# EAGLE board spi1.1 (EAGLE 6.1)
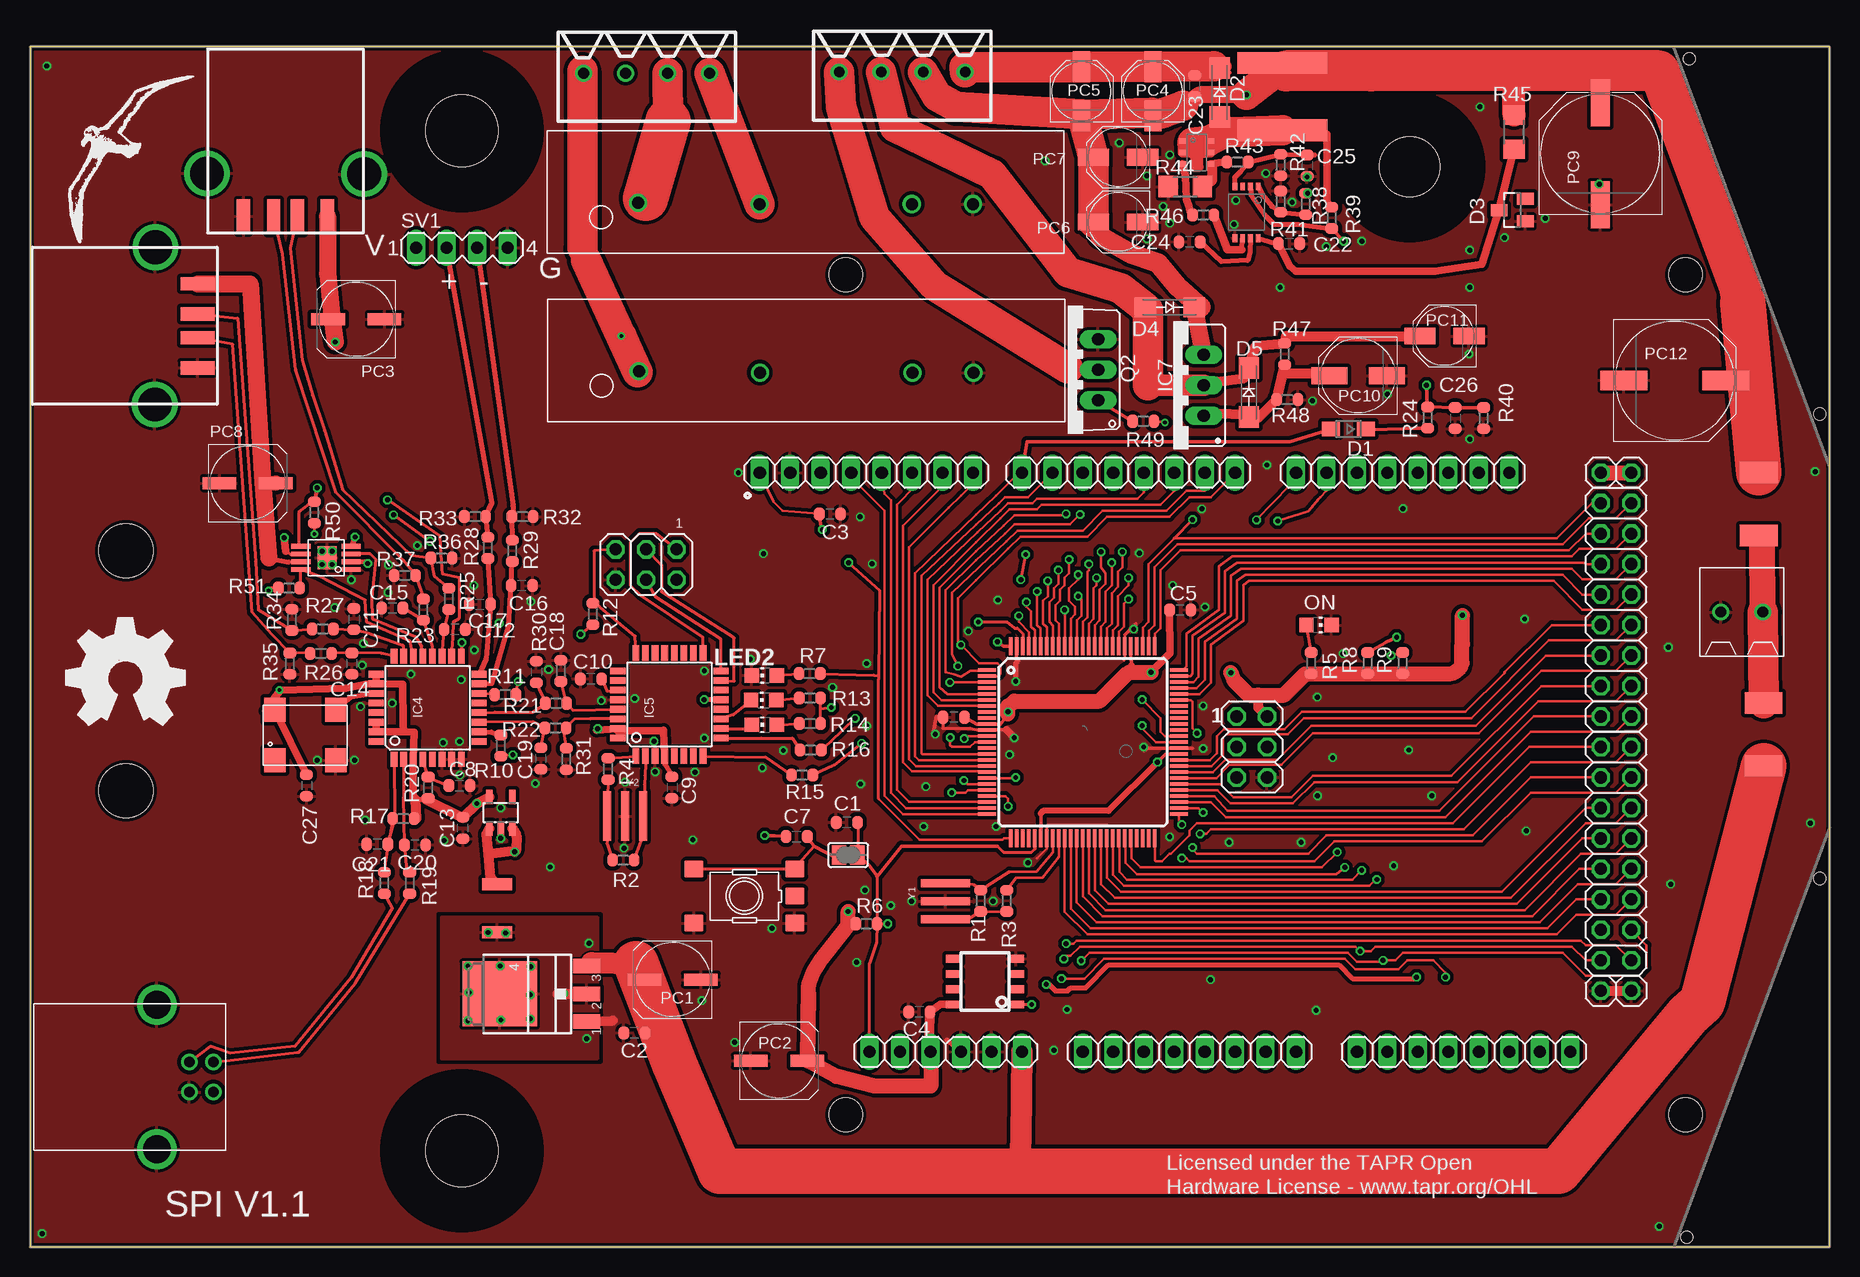
[diagram p2: board, top side]
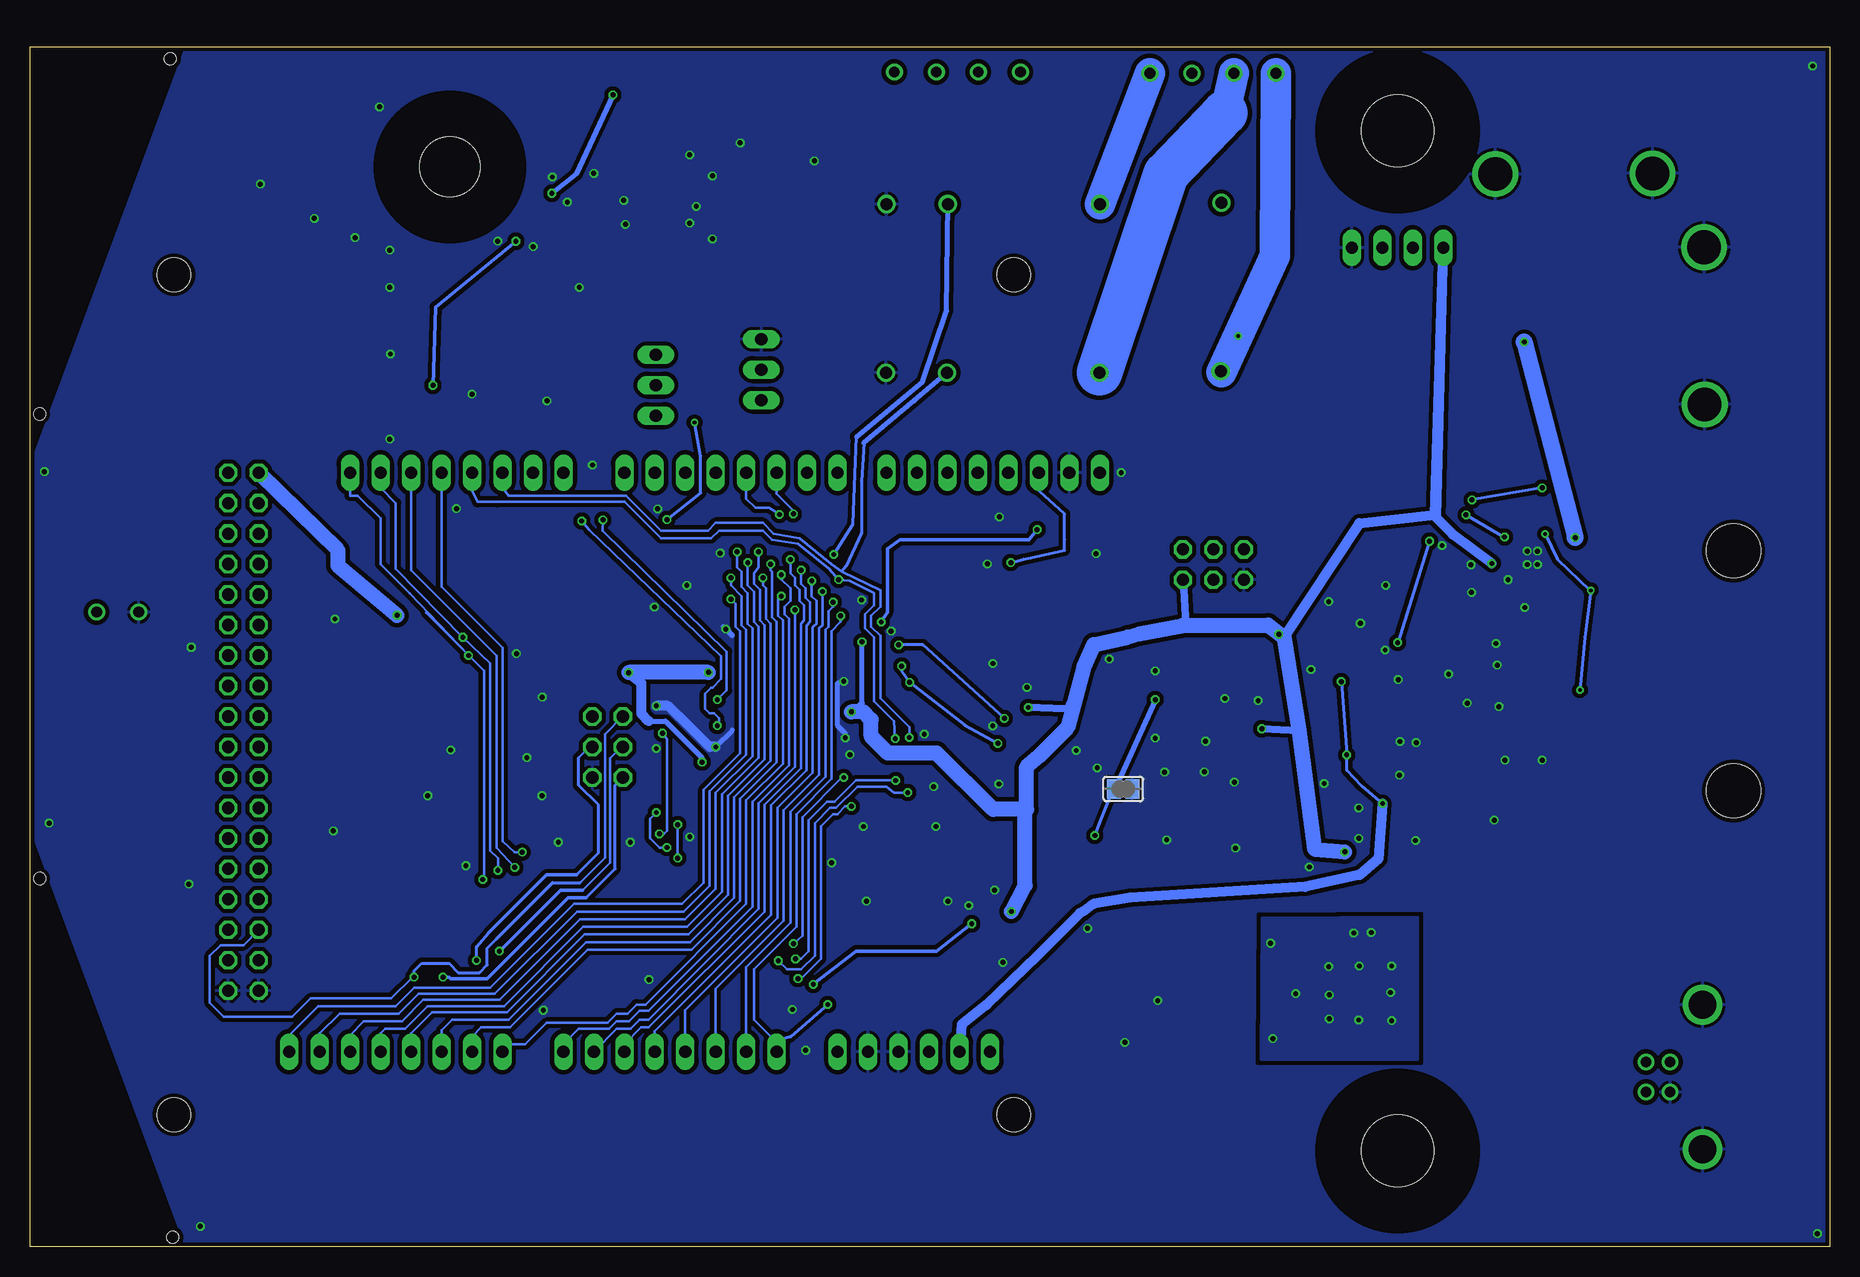
[diagram p3: board, bottom side, seen from below]

Size 150 x 100 mm. Coordinates in mm from the lower left corner, seen from the top.
Outline: 0,0 150,0 150,100 0,100 0,0
Copper layers (1*16): Top 0.035mm / dielectric 1.5mm / Bottom 0.035mm
Design rules: minimum track width 6mil, minimum drill 12mil, track to track 6mil, track to pad 6mil, pad to pad 6mil, via to via 6mil, smd to smd 0mil, copper to edge 10mil, drill to drill 10mil, minimum pad ring 10mil, minimum via ring 6mil, stop-mask expansion 2mil, vias tented up to drill 100mil, thermal gap 10mil
Net classes: 0 default: width 0.152 mm, drill 0.305 mm, clearance 0.152 mm
Holes 6 mm at 36,93 36,8
Holes 5 mm at 115,90
Holes 2.8 mm at 138,81 68,81 68,11 138,11
Holes 4.5 mm at 8,58 8,38
Holes 1 mm at 138.3,99 149.2,69.4 149.2,30.7 138.1,0.8
tKeepout: area 65,8 to 71,14; area 135,8 to 141,14; area 135,78 to 141,84; area 65,78 to 71,84; area 4,54 to 12,62; area 4,34 to 12,42
bKeepout: area 0,28 to 16,68
tRestrict: area 109,84 to 121,96; area 29.5,1.5 to 42.5,14.5; area 29.5,86.5 to 42.5,99.5
bRestrict: area 29.5,86.5 to 42.5,99.5; area 109,84 to 121,96; area 29.5,1.5 to 42.5,14.5

## Footprints (pad centres in the part's own frame; a part is rotated, then mirrored left to right if it is on the bottom)
1X08 = drill 1.016 long: 1 -8.89,0; 2 -6.35,0; 3 -3.81,0; 4 -1.27,0; 5 1.27,0; 6 3.81,0; 7 6.35,0; 8 8.89,0
C0603-ROUND = smd 0.898 x 1.1: 1 -0.889,0; 2 0.889,0
SOD323-W = smd 1.5 x 1.2: A 1.45,0; C -1.45,0
SMA-DO214AC = smd 1.8 x 1.7: A -2.05,0; K 2.05,0
SOT23 = smd 1 x 1.4: 1 -0.95,-1.1; 2 0.95,-1.1; 3 0,1.1
POLY6 = smd 2.5 x 1: 1 0,2; 2 0,-2
POLY15 = smd 3.15 x 1.78: 1 0,2.615; 2 0,-2.615
SOT223 = smd 1.219 x 2.235: 1 -2.311,-3.099; 2 0,-3.099; 3 2.311,-3.099 | smd 3.6 x 2.2: 4 0,3.099
DPACK = smd 1 x 1.6: 1 -2.28,-4.8; 3 2.28,-4.8 | smd 5.4 x 6.2: 2 0,2.5
TQFP100 = smd 1.5 x 0.3: 1 -8,6; 2 -8,5.5; 3 -8,5; 4 -8,4.5; 5 -8,4; 6 -8,3.5; 7 -8,3; 8 -8,2.5; 9 -8,2; 10 -8,1.5; 11 -8,1; 12 -8,0.5; 13 -8,0; 14 -8,-0.5; 15 -8,-1; 16 -8,-1.5; 17 -8,-2; 18 -8,-2.5; 19 -8,-3; 20 -8,-3.5; 21 -8,-4; 22 -8,-4.5; 23 -8,-5; 24 -8,-5.5; 25 -8,-6; 51 8,-6; 52 8,-5.5; 53 8,-5; 54 8,-4.5; 55 8,-4; 56 8,-3.5; 57 8,-3; 58 8,-2.5; 59 8,-2; 60 8,-1.5; 61 8,-1; 62 8,-0.5; 63 8,0; 64 8,0.5; 65 8,1; 66 8,1.5; 67 8,2; 68 8,2.5; 69 8,3; 70 8,3.5; 71 8,4; 72 8,4.5; 73 8,5; 74 8,5.5; 75 8,6 | smd 0.3 x 1.5: 26 -6,-8; 27 -5.5,-8; 28 -5,-8; 29 -4.5,-8; 30 -4,-8; 31 -3.5,-8; 32 -3,-8; 33 -2.5,-8; 34 -2,-8; 35 -1.5,-8; 36 -1,-8; 37 -0.5,-8; 38 0,-8; 39 0.5,-8; 40 1,-8; 41 1.5,-8; 42 2,-8; 43 2.5,-8; 44 3,-8; 45 3.5,-8; 46 4,-8; 47 4.5,-8; 48 5,-8; 49 5.5,-8; 50 6,-8; 76 6,8; 77 5.5,8; 78 5,8; 79 4.5,8; 80 4,8; 81 3.5,8; 82 3,8; 83 2.5,8; 84 2,8; 85 1.5,8; 86 1,8; 87 0.5,8; 88 0,8; 89 -0.5,8; 90 -1,8; 91 -1.5,8; 92 -2,8; 93 -2.5,8; 94 -3,8; 95 -3.5,8; 96 -4,8; 97 -4.5,8; 98 -5,8; 99 -5.5,8; 100 -6,8
TQFP32-08 = smd 1.27 x 0.559: 1 -4.293,2.8; 2 -4.293,2; 3 -4.293,1.2; 4 -4.293,0.4; 5 -4.293,-0.4; 6 -4.293,-1.2; 7 -4.293,-2; 8 -4.293,-2.8; 17 4.293,-2.8; 18 4.293,-2; 19 4.293,-1.2; 20 4.293,-0.4; 21 4.293,0.4; 22 4.293,1.2; 23 4.293,2; 24 4.293,2.8 | smd 0.559 x 1.27: 9 -2.8,-4.293; 10 -2,-4.293; 11 -1.2,-4.293; 12 -0.4,-4.293; 13 0.4,-4.293; 14 1.2,-4.293; 15 2,-4.293; 16 2.8,-4.293; 25 2.8,4.293; 26 2,4.293; 27 1.2,4.293; 28 0.4,4.293; 29 -0.4,4.293; 30 -1.2,4.293; 31 -2,4.293; 32 -2.8,4.293
SOT23-DBV = smd 0.55 x 1.2: 1 -0.95,-1.3; 2 0,-1.3; 3 0.95,-1.3; 4 0.95,1.3; 5 -0.95,1.3
317TS = drill 1.016 long: 1 -2.54,-2.54; 2 0,-2.54; 3 2.54,-2.54
DGN-8 = smd 1.6 x 0.4: 1 -2.1,0.975; 2 -2.1,0.325; 3 -2.1,-0.325; 4 -2.1,-0.975; 5 2.1,-0.975; 6 2.1,-0.325; 7 2.1,0.325; 8 2.1,0.975 | smd 1.57 x 1.89: GG -0.1,0
USOP-8 = smd 0.66 x 0.4: 1 -2.16,0.975; 2 -2.16,0.325; 3 -2.16,-0.325; 4 -2.16,-0.975; 5 2.16,-0.975; 6 2.16,-0.325; 7 2.16,0.325; 8 2.16,0.975
2X03 = drill 1.016 octagon: 1 -2.54,-1.27; 2 -2.54,1.27; 3 0,-1.27; 4 0,1.27; 5 2.54,-1.27; 6 2.54,1.27
USB-B = drill 0.9: 1 1.25,14.99; 2 -1.25,14.99; 3 -1.25,12.99; 4 1.25,12.99 | drill 2.3: G1 -6.02,10.28; G2 6.02,10.28
USB-A = smd 2.87 x 1.118: + 3.581,3.505; - 3.581,-3.505; D+ 3.581,-0.991; D- 3.581,0.991 | drill 2.8: G1 0.051,6.553; G2 0,-6.553
TERM3.5-4 = drill 0.9: 1 -5.25,0; 2 -1.75,0; 3 1.75,0; 4 5.25,0
TERM3.5-2 = drill 0.9: 1 1.75,0; 2 -1.75,0
1X01 = drill 1.016 octagon: 1 0,0
INDUCT1 = smd 7.5 x 1.8: 1 0,2.8; 2 0,-2.8
CHIP-LED0805 = smd 1.2 x 1.2: A 0,-1.05; C 0,1.05
UD-6,3X7,7_NICHICON = smd 2.8 x 1: + 2.35,0; - -2.35,0
PANASONIC_C = smd 2.6 x 1.4: + 2.05,0; - -2.05,0
PANASONIC_G = smd 3.9 x 1.6: + 4.25,0; - -4.25,0
PANASONIC_D = smd 3 x 1.4: + 2.4,0; - -2.4,0
1X06 = drill 1.016 long: 1 -6.35,0; 2 -3.81,0; 3 -1.27,0; 4 1.27,0; 5 3.81,0; 6 6.35,0
TO220AV = drill 1.016 long: B -2.54,-2.54; C 0,-2.54; E 2.54,-2.54
R0603-ROUND = smd 0.898 x 1.1: 1 -0.889,0; 2 0.889,0
R1206 = smd 1.6 x 1.803: 1 -1.422,0; 2 1.422,0
XRELAY = drill 1: 1 -27.9,0.1; 2 -17.8,0; 3 -5.1,0; 4 0,0
TS42 = smd 1.6 x 1.4: 1 -4.2,2.25; 2 4.2,2.25; 3 -4.2,-2.25; 4 4.2,-2.25; 5 -4.2,0
SJ = smd 1.168 x 1.6: 1 -0.762,0; 2 0.762,0
MA04-1 = drill 1.016 long: 1 -3.81,0; 2 -1.27,0; 3 1.27,0; 4 3.81,0
SS08 = smd 1.27 x 0.635: 1 -2.6,1.905; 2 -2.6,0.635; 3 -2.6,-0.635; 4 -2.6,-1.905; 5 2.6,-1.905; 6 2.6,-0.635; 7 2.6,0.635; 8 2.6,1.905
TSOP6 = smd 0.45 x 0.6: 1 -0.95,-1.17; 2 0,-1.17; 3 0.95,-1.17; 4 0.95,1.17; 5 0,1.17; 6 -0.95,1.17
2X08 = drill 1.016 octagon: 1 -8.89,-1.27; 2 -8.89,1.27; 3 -6.35,-1.27; 4 -6.35,1.27; 5 -3.81,-1.27; 6 -3.81,1.27; 7 -1.27,-1.27; 8 -1.27,1.27; 9 1.27,-1.27; 10 1.27,1.27; 11 3.81,-1.27; 12 3.81,1.27; 13 6.35,-1.27; 14 6.35,1.27; 15 8.89,-1.27; 16 8.89,1.27
RESONATOR1 = smd 0.7 x 4.1: 1 -1.5,0; 2 0,0; 3 1.5,0
XTAL1 = smd 1.8 x 2: 1 -2.54,-2.1; 2 2.54,-2.1; 3 2.54,2.1; 4 -2.54,2.1

## Placement (x,y rotation side)
ADCH  1X08  [1X08]  119.51,16.26 0 top
ADCL  1X08  [1X08]  96.65,16.26 0 top
C1  22p  [C0603-ROUND]  68.1,35.37 180 top
C2  100n  [C0603-ROUND]  50.38,17.83 180 top
C3  100n  [C0603-ROUND]  66.67,61.09 0 top
C4  100n  [C0603-ROUND]  74.14,19.57 180 top
C5  100n  [C0603-ROUND]  95.89,53.09 0 top
C6  100n  [C0603-ROUND]  77,44.13 180 top
C7  100n  [C0603-ROUND]  63.9,34.2 0 top
C8  100n  [C0603-ROUND]  35.8,38.44 0 top
C9  100n  [C0603-ROUND]  53.51,38.28 270 top
C10  1u  [C0603-ROUND]  46.77,47.33 180 top
C11  22pf  [C0603-ROUND]  27,52.3 270 top
C12  22pf  [C0603-ROUND]  35.4,51.45 180 top
C13  100n  [C0603-ROUND]  36.09,34.9 90 top
C14  22pf  [C0603-ROUND]  26.85,48.6 90 top
C15  22pf  [C0603-ROUND]  30.2,53.25 0 top
C16  22pf  [C0603-ROUND]  41,55.1 180 top
C17  22pf  [C0603-ROUND]  37.5,53.55 0 top
C18  22pf  [C0603-ROUND]  42.2,47.9 270 top
C19  22pf  [C0603-ROUND]  42.6,40.7 90 top
C20  22pf  [C0603-ROUND]  32.1,33.5 0 top
C21  22pf  [C0603-ROUND]  28.95,33.55 180 top
C22  100n 50v  [C0603-ROUND]  104.95,83.6 0 top
C23  100n 50v  [C0603-ROUND]  97.1,96.75 90 top
C24  100n 50v  [C0603-ROUND]  96.65,83.75 180 top
C25  470pf 50v  [C0603-ROUND]  106.45,90.1 270 top
C26  1nF 50v  [C0603-ROUND]  118.8,69.05 270 top
C27  10nF  [C0603-ROUND]  23.05,38.45 270 top
COMMUNICATION  1X08  [1X08]  114.43,64.52 180 top
D1  SD103CWS  [SOD323-W]  109.9,68.15 180 top
D2  CMSH1-60M  [SMA-DO214AC]  99.15,96.2 90 top
D3  MMBZ5251B-V  [SOT23]  123.55,86.4 90 top
D4  1N4004  [SMA-DO214AC]  95,78.3 0 top
D5  1N4004  [SMA-DO214AC]  101.6,71.2 90 top
F1  1210L035YR  [POLY6]  38.95,28.2 180 top
F2  1812L050PR  [POLY15]  144.5,42.7 0 top
F3  1812L050PR  [POLY15]  144.1,61.9 180 top
IC1  MC33269ST-5.0T3  [SOT223]  43.31,21.08 90 top
IC2  MC33269D-5.0  [DPACK]  41.66,21.08 90 top
IC3  ATMEGA2560-16AU  [TQFP100]  87.76,42.06 0 top
IC4  TUSB2046VF  [TQFP32-08]  33.15,44.92 90 top
IC5  AT90USB162  [TQFP32-08]  53.3,45.19 90 top
IC6  LP2985-33DBVR  [SOT23-DBV]  39.24,36.18 0 top
IC7  LM350  [317TS]  95.3,71.8 90 top
IC8  TPS2042B-DGN  [DGN-8]  24.68,57.42 180 top
IC9  MAX16802  [USOP-8]  101.4,86.2 270 top
ICSP  ICSP  [2X03]  101.85,41.66 270 top
ICSP1  ICSP  [2X03]  51.36,56.85 180 top
J43  USB-B-FCI  [USB-B]  0.3,14.15 270 top
J44  USB-A_S_RA  [USB-A]  21.3,89.45 270 top
J45  USB-A_S_RA  [USB-A]  10.4,76.75 0 top
J46  BLOCK4  [TERM3.5-4]  51.4,97.8 0 top
J47  BLOCK4  [TERM3.5-4]  72.7,97.9 0 top
J49  TERM-3.5-2  [TERM3.5-2]  142.7,52.9 0 top
JP1  [1X01]  130.94,64.52 0 top
JP2  [1X01]  133.48,64.52 0 top
JP3  [1X01]  130.94,21.34 0 top
JP4  [1X01]  133.48,21.34 0 top
L1  SRN3015-4R7M  [INDUCT1]  104.4,95.85 180 top
LED2  YELLOW  [CHIP-LED0805]  61.21,47.62 90 top
LED3  YELLOW  [CHIP-LED0805]  61.16,45.56 90 top
LED4  YELLOW  [CHIP-LED0805]  61.21,43.51 90 top
LOGO2  OSHW_LOGO_FILLX0350-NT  [OSHW_FILLX350_NOTEXT]  3,43.5 0 top
ON  LED1  [CHIP-LED0805]  107.44,51.82 270 top
PC1  47u  [UD-6,3X7,7_NICHICON]  53.57,22.28 180 top
PC2  47u  [UD-6,3X7,7_NICHICON]  62.43,15.5 0 top
PC3  100u  [UD-6,3X7,7_NICHICON]  27.2,77.3 180 top
PC4  4.7uF 50v  [PANASONIC_C]  93.6,96.3 90 top
PC5  4.7uF 50v  [PANASONIC_C]  87.65,96.3 90 top
PC6  4.7uF 50v  [PANASONIC_C]  90.7,85.4 180 top
PC7  4.7uF 50v  [PANASONIC_C]  90.7,90.8 180 top
PC8  100u  [UD-6,3X7,7_NICHICON]  18.15,63.65 0 top
PC9  220uF 50v  [PANASONIC_G]  130.9,91.1 90 top
PC10  10uF 50v  [PANASONIC_D]  110.7,72.6 180 top
PC11  4.7uF 12v  [PANASONIC_C]  117.9,75.9 180 top
PC12  220uF 50v  [PANASONIC_G]  137.1,72.2 0 top
POWER  1X06  [1X06]  76.33,16.26 0 top
PWMH  1X08  [1X08]  69.72,64.52 180 top
PWML  1X08  [1X08]  91.57,64.52 180 top
Q2  TIP120  [TO220AV]  86.5,73.1 90 top
R1  1M  [R0603-ROUND]  79.25,28.83 90 top
R2  1M  [R0603-ROUND]  49.46,32.22 0 top
R3  27R  [R0603-ROUND]  81.41,28.83 270 top
R4  27R  [R0603-ROUND]  48.19,39.83 270 top
R5  1k  [R0603-ROUND]  106.81,48.64 270 top
R6  10k  [R0603-ROUND]  69.72,26.92 0 top
R7  1k  [R0603-ROUND]  64.99,47.77 0 top
R8  10k  [R0603-ROUND]  111.51,48.64 90 top
R9  10k  [R0603-ROUND]  114.41,48.64 90 top
R10  10k  [R0603-ROUND]  39.24,41.77 270 top
R11  10k  [R0603-ROUND]  39.61,46.01 0 top
R12  10k  [R0603-ROUND]  46.92,52.74 90 top
R13  1k  [R0603-ROUND]  65.02,45.74 180 top
R14  1k  [R0603-ROUND]  65.02,43.61 180 top
R15  1k  [R0603-ROUND]  64.37,39.31 0 top
R16  1k  [R0603-ROUND]  65.07,41.39 0 top
R17  1.5k  [R0603-ROUND]  31.12,35.69 0 top
R18  27R  [R0603-ROUND]  29.54,30.32 270 top
R19  27R  [R0603-ROUND]  31.65,30.32 270 top
R20  10k  [R0603-ROUND]  33.19,38.26 270 top
R21  27R  [R0603-ROUND]  43.85,45.3 180 top
R22  27R  [R0603-ROUND]  43.8,43.25 180 top
R23  27R  [R0603-ROUND]  32.8,53.1 270 top
R24  1k 1%  [R0603-ROUND]  116.5,69.1 270 top
R25  27R  [R0603-ROUND]  34.9,54 270 top
R26  27R  [R0603-ROUND]  24.25,49.45 0 top
R27  27R  [R0603-ROUND]  24.4,51.5 0 top
R28  27R  [R0603-ROUND]  38.15,58.25 270 top
R29  27R  [R0603-ROUND]  40.2,58 270 top
R30  15k  [R0603-ROUND]  44.25,48 90 top
R31  15k  [R0603-ROUND]  44.7,40.65 270 top
R32  15k  [R0603-ROUND]  41.05,60.85 0 top
R33  15k  [R0603-ROUND]  37.1,60.85 180 top
R34  15k  [R0603-ROUND]  21.85,52.25 90 top
R35  15k  [R0603-ROUND]  21.65,48.6 270 top
R36  15k  [R0603-ROUND]  34.3,57.4 0 top
R37  15k  [R0603-ROUND]  31.25,55.95 180 top
R38  499k 1%  [R0603-ROUND]  106.35,86.9 270 top
R39  392k 1%  [R0603-ROUND]  108.5,85.75 270 top
R40  11k 1%  [R0603-ROUND]  121.15,69.05 270 top
R41  73k2 1%  [R0603-ROUND]  104.25,87.1 90 top
R42  1k 1%  [R0603-ROUND]  104.25,90.15 270 top
R43  220 1%  [R0603-ROUND]  100.65,90.4 0 top
R44  ,1 1%  [R1206]  96.3,88.35 180 top
R45  330 1%  [R1206]  123.7,92.9 270 top
R46  1  [R0603-ROUND]  97.8,86 0 top
R47  120  [R0603-ROUND]  104.6,74.4 270 top
R48  180  [R0603-ROUND]  104.8,70.6 0 top
R49  120  [R0603-ROUND]  92.8,68.8 180 top
R50  10k  [R0603-ROUND]  23.7,61.2 270 top
R51  10k  [R0603-ROUND]  21.6,54.9 180 top
RELAY1  XRELAY  [XRELAY]  78.6,86.9 0 top
RELAY2  XRELAY  [XRELAY]  78.65,72.85 0 top
RESET  TS42  [TS42]  59.54,29.23 180 top
RESET-EN  [SJ]  68.2,32.66 0 top
SV1  DNS  [MA04-1]  36,83.25 0 top
U$1  LM34  [SS08]  79.6,22.1 180 top
U$6  SI3458DVB  [TSOP6]  97.25,91.2 270 top
U$15  LOGO  [LOGO]  2.9,98.45 270 top
UBOOT  [SJ]  58.87,38.16 0 bottom
XIOH  2X08  [2X08]  132.21,53.09 90 top
XIOL  2X08  [2X08]  132.21,32.77 90 top
Y1  AWSCR  [RESONATOR1]  76.3,28.8 270 top
Y2  AWSCR  [RESONATOR1]  49.6,35.9 180 top
Y3  48MHZ  [XTAL1]  22.95,42.65 0 top

## Tracks (layer width: path | path; a pad name or v marks a point on that pad's centre or on a via)
+3V3  (via drill 0.3, 0.41)
  Top 0.254: 36.1,35.75 v37.25,36.94 | R11.2 v40.7,47.1 | v40.25,41 R10.2 | R20.2 33,37.3 | R17.2 32.2,35.69 32.15,35.75 | R51.2 19.9,54.9 v19.9,54.7 | v20.8,46.4 20.75,46.27 | R50.2 v23.7,59.4
  Top 0.406: 33,37.3 31.95,37.3 32.1,37.3 | 19.55,44.65 19.8,44.98 Y3.4
  Top 0.61: IC4.25 IC4.26 | IC4.30 IC4.31 31.13,42.94 | 31.95,37.3 IC4.3 32,42.9 31.13,42.94 | IC4.26 31.05,46.9 31.1,43.65 31.13,42.94 | IC4.26 28,46.9 26.3,46.55 20.85,46.4 20.75,46.27 19.8,44.98 | C27.1 Y3.4
  Top 0.813: 33,37.3 36.1,35.75 | IC6.5 v37.25,36.94 C13.2 | 32.1,37.3 32.2,35.69
  Bottom 0.254: v40.7,47.1 v40.25,41 40.25,39.7 39,38.4 v37.25,36.94 | v20.8,46.4 20.4,50.8 v19.9,54.7 20,54.7 22.7,57.3 v23.7,59.4
  Bottom 0.61: 62.23,27.94 62.48,27.81
  Bottom 0.813: 62.48,27.81 66.04,24.26 70.27,20.16 72.35,18.53 POWER.2 | 62.23,27.94 61.34,28.57 58.3,29.1 43.7,30 39.15,31 37.6,32.35 v37.25,36.94
+5V  (via drill 0.41)
  Top 0.254: IC3.80 91.77,50.01 91.75,49.99 91.77,49.96 91.77,49.12 | 94.61,41.02 94.66,41.06 | R9.1 R5.2 | R6.1 68.2,26.76 | 65.91,44.83 v66.79,44.95 | R14.1 65.91,44.83 | 65.91,44.83 R13.1 | IC5.31 48.98,42.53 IC5.32 48.97,42.99 | IC5.4 | 47.23,43.04 v47.32,43.17 | v45.9,51.05 R12.1 | 52.72,43.02 52.8,43.1 | 119.3,47.9 118.3,47.75
  Top 0.305: 91.82,48.39 91.82,48.82 91.77,48.87 91.77,49.12 | 94.66,41.06 IC3.61 | v93.98,40.39 94.61,41.02 | 81.41,44.2 80.9,43.56 IC3.10 78.95,43.56 C6.1 | IC3.100 81.13,50.06 v80.64,50.42 | 84.26,36.12 IC3.31
  Top 0.406: 81.5,44.42 81.41,44.2 v81.53,44.58 | IC5.4 52.92,40.21 53.44,39.37 C9.1 | v28.15,56.95 27.9,57.05 IC8.2 | 65.6,15.1 65.6,15.5 64.83,15.5 PC2.+ | 52.8,43.05 52.8,43.1 | 76.9,20.2 U$1.8
  Top 0.508: 84.26,36.12 84.45,36.32 89.92,36.32 v93.98,40.39
  Top 0.61: 91.82,48.39 91.82,48.01 91.95,47.88 | C5.1 95.03,49.47 v93.45,47.88 | IC5.31 47.23,43.04 | 48.97,42.99 52.72,43.02 | IC5.4 52.8,43.05 | C4.1 75.9,20.2 76.9,20.2
  Top 0.813: C4.1 74.98,17.65 POWER.3 | 119.27,48.31 119.37,48.64 | 102.36,45.97 102.36,44.96 ICSP.2 | F1.2 38.4,30.75 38.21,32.72 | 38.21,32.72 38.05,34.4 IC6.1 | IC6.3 40.55,34.25 40.5,33 | 40.5,33 38.21,32.72 | 40.5,33 v40.41,32.91
  Top 1.27: JP1.1 JP2.1 | v100.1,47.85 100.33,47.24 101.6,45.97 102.36,45.97 104.52,45.97 106.3,47.75 R5.2 R8.1 R9.1 118.3,47.75 118.71,47.85 119.27,48.31 | 119.37,48.64 119.37,50.16 119.4,50.22 v119.4,52.63 | 81.5,44.42 81.5,45.05 82.04,45.47 89.15,45.47 91.57,47.88 91.95,47.88 v93.45,47.88 | v68.2,27.94 68.2,26.76 65.84,23.78 65.32,22.93 64.9,21.81 64.83,15.5 | 64.9,21.08 64.83,15.5 | POWER.3 75.1,13.4 70.4,13.4 67.2,14.2 64.83,15.5
  Bottom 0.254: 63.7,44.85 62.15,48.29 | 45.47,50.8 45.62,50.9 | v47.32,43.17 44.7,43.05 44.45,43.05 44.3,42.25 | 47.99,51.79 v45.9,51.05 | 67.06,36.45 66.93,36.45
  Bottom 0.406: v81.53,44.58 81.53,44.45 80.64,45.34 v80.64,50.42 | 98.42,43.81 97.03,43.81 93.98,40.77 v93.98,40.39 | 53.86,55.57 ICSP1.2 53.9,55.6 ICSP1.2
  Bottom 0.61: 100.08,47.88 v100.1,47.85 | v66.79,44.95 63.7,44.85 | 53.86,55.57 53.66,51.79 | 44.21,43.02 v47.32,43.17
  Bottom 0.813: 98.42,43.81 99.06,44.45 99.06,46.99 v100.1,47.85 | v28.15,56.95 31.41,59.36 32.78,60.77 SV1.1 32.9,61 39.2,60.3 45.47,50.8
  Bottom 1.27: v93.45,47.88 100.08,47.88 | v81.53,44.58 80.52,44.58 79.88,43.94 79.88,42.55 78.49,41.15 74.42,41.15 69.72,36.45 67.06,36.45 67.06,30.1 v68.2,27.94 | JP1.1 124.33,58.04 124.33,56.77 v119.4,52.63 | 66.93,36.45 66.93,40.01 65.91,40.89 63.5,43.31 62.15,48.29 61.33,50.19 58.51,50.82 57.54,51.07 53.96,51.77 53.66,51.79 47.99,51.79 46.77,51.8 45.47,50.8 44.21,43.02 42.93,33.15 v40.41,32.91
+12V
  Top 0.203: IC2.3 46.44,23.36 IC1.3
  Top 0.406: C2.1 53.72,15.2 | 51.17,22.28 50.5,23.6 | 51.29,21.54 51.29,22.28 PC1.+ 51.17,21.84
  Top 0.61: IC2.3 46.8,23.66
  Top 1.778: POWER.6 82.6,9.1 82.5,6.3 | 46.8,23.66 50.5,23.6
  Top 3.81: F2.2 139.38,20.4 138.2,19.3 127.4,6.3 82.5,6.3 57.5,6.3 53.72,15.2 51.17,21.84 50.5,23.6
+12VPWR  (via drill 0.41)
  Top 0.254: 97.5,96 97.3,95.8 C23.1 | 120.7,98.2 122.1,98.2 122,98.27 | PC12.+ 143.4,79.3 | 87.7,94.35 87.7,94.4 | 94.5,94.05 94.5,94.5 | 97.6,78.3 D4.K
  Top 0.406: v106.5,87.8 R38.1 | PC9.+ 130.8,95.35 130.8,98.5 129.3,98.5 129.3,97.7 129.1,97.7 129.1,97.8 | 143.4,79.3 142.9,79.2 142.9,78.8 | 142.9,78.8 142.9,78.7 | 142.75,78.66 142.5,78.86 142.5,78.8 142.9,78.8 | 142.9,78.8 143,78.8 143,78.5
  Top 1.016: 129.1,97.8 129.1,98.8
  Top 1.422: v101.4,96 97.5,96 96.1,95.1 | IC7.3 D4.K
  Top 1.676: PC6.+ 89.2,84.2 91.7,82.8 94,82 95.6,80.1 97.6,78.3
  Top 1.778: L1.2 103.8,97.9
  Top 1.93: R45.1 123.71,98 | 123.71,98 122.9,98.28 | 123.71,98 129.1,97.8 | 104.7,98 L1.2
  Top 2.54: PC6.+ PC7.+ 87.7,94.35 93.5,94.5 PC4.- 94.5,94.5 96.1,95.1 | 103.8,97.9 v101.4,96 | 122,98.27 122.9,98.28 | J47.3 75.6,95.9 77.2,95 87.7,94.4 PC5.-
  Top 3.4: 142.6,79.7 135.8,98 123.71,98 111.8,98 104.7,98
  Top 3.5: 142.75,78.66 142.6,79.7
  Top 3.81: F3.2 142.75,78.66
  Bottom 0.406: v101.4,96 104.5,89.4 v106.5,87.8
ADC0  (via drill 0.41)
  Top 0.203: IC3.97 83.26,51.24 82.42,52.07 v82.42,52.58
  Top 0.254: U$1.1 v83.5,20.2
  Bottom 0.203: ADCL.1 87.76,17.02 87.87,17.13 89.66,18.92 89.66,23.11 86.11,26.67 86.11,36.07 83.19,38.99 83.19,51.31 82.42,52.07 v82.42,52.58
  Bottom 0.254: v83.5,20.2 86.6,17.5 87.87,17.13
ADC1  (via drill 0.41)
  Top 0.203: IC3.96 83.76,51.37 83.44,51.69 83.44,52.96 83.06,53.34 v83.06,53.72
  Bottom 0.203: ADCL.2 90.3,23.32 86.59,27.03 86.59,36.27 83.69,39.17 83.69,51.44 83.44,51.69 83.44,52.96 83.06,53.34 v83.06,53.72
ADC2  (via drill 0.41)
  Top 0.203: v83.95,54.61 83.95,51.82 84.23,51.54 84.23,50.39 84.33,50.29 84.26,50.22 84.26,50.09 84.22,50.06 | 84.22,50.06 84.2,50.04 | 84.22,50.06 IC3.95
  Bottom 0.203: ADCL.3 92.84,21.51 87.17,27.18 87.17,36.4 84.23,39.34 84.23,51.54 83.95,51.82 v83.95,54.61
ADC3  (via drill 0.41)
  Top 0.203: IC3.94 84.76,51.64 84.45,51.94 84.45,53.85 84.84,54.23 v84.84,55.5
  Bottom 0.203: ADCL.4 95.38,16.46 95.48,16.56 95.48,16.76 95.38,16.87 95.38,19.74 87.71,27.41 87.71,36.58 84.76,39.52 84.76,51.56 84.71,51.69 84.45,51.94 84.45,53.85 84.84,54.23 v84.84,55.5
ADC4  (via drill 0.41)
  Top 0.203: IC3.93 85.26,51.78 84.96,52.07 84.96,53.72 85.34,54.1 85.34,54.86 85.72,55.24 v85.72,56.39
  Bottom 0.203: 97.92,16.15 ADCL.5 97.92,17.98 88.21,27.69 88.21,36.78 85.27,39.73 85.27,51.77 84.96,52.07 84.96,53.72 85.34,54.1 85.34,54.86 85.72,55.24 v85.72,56.39
ADC5  (via drill 0.41)
  Top 0.203: IC3.92 85.76,51.91 85.47,52.2 85.47,53.47 85.85,53.85 85.85,54.74 86.23,55.12 86.23,55.75 86.61,56.13 v86.61,57.28
  Bottom 0.203: v86.61,57.28 86.61,56.13 86.23,55.75 86.23,55.12 85.85,54.74 85.85,53.85 85.47,53.47 85.47,52.2 85.72,51.94 85.72,39.88 88.77,36.83 88.77,27.94 98.42,18.29 99.06,18.29 100.46,16.89 ADCL.6
ADC6  (via drill 0.41)
  Top 0.203: IC3.91 86.26,53.06 v86.23,53.09
  Bottom 0.203: v86.23,53.09 86.23,40.01 89.28,36.96 89.28,28.19 98.42,18.92 99.19,18.92 99.95,18.16 101.09,18.16 ADCL.7
ADC7  (via drill 0.41)
  Top 0.203: IC3.90 86.76,52.34 87.12,52.7 87.12,53.34 86.61,53.85 86.61,54.86 87.38,55.63 v87.38,56.01
  Bottom 0.203: v87.38,56.01 87.38,55.63 86.61,54.86 86.61,53.85 87.12,53.34 87.12,52.7 86.74,52.32 86.74,40.13 89.79,37.08 89.79,28.32 98.42,19.68 99.19,19.68 100.08,18.8 101.09,18.8 101.73,18.16 104.27,18.16 105.54,16.89 | 105.54,16.89 ADCL.8 | 105.54,16.89 105.54,17.65
ADC8  (via drill 0.41)
  Top 0.203: IC3.89 87.26,52.2 87.63,52.58 87.63,53.98 v87.38,54.23
  Bottom 0.203: v87.38,54.23 87.63,53.98 87.63,52.58 87.25,52.2 87.25,40.26 90.3,37.21 90.3,28.57 98.68,20.19 99.44,20.19 100.2,19.43 101.09,19.43 101.85,18.67 106.93,18.67 108.71,16.89 110.62,16.89 ADCH.1
ADC9  (via drill 0.41)
  Top 0.203: IC3.88 87.76,52.07 88.14,52.45 88.14,56.26 88.27,56.39 v88.27,56.9
  Bottom 0.203: v88.27,56.9 88.27,56.39 88.14,56.26 88.14,52.45 87.76,52.07 87.76,40.39 90.81,37.34 90.81,28.83 94.87,24.77 103.5,24.77 109.98,18.29 112.39,18.29 113.16,17.53 ADCH.2
ADC10  (via drill 0.41)
  Top 0.203: IC3.87 88.26,51.94 88.65,52.32 88.65,54.86 88.9,55.12 v88.9,55.75
  Bottom 0.203: v88.9,55.75 88.9,55.12 88.65,54.86 88.65,52.32 88.27,51.94 88.27,40.51 91.31,37.47 91.31,29.08 95,25.4 103.63,25.4 110.11,18.92 114.81,18.92 115.7,18.03 ADCH.3
ADC11  (via drill 0.41)
  Top 0.203: IC3.86 88.76,51.8 89.15,52.2 89.15,54.74 89.66,55.24 89.66,56.13 89.28,56.64 v89.28,57.91
  Bottom 0.203: v89.28,57.91 89.28,56.64 89.66,56.13 89.66,55.24 89.15,54.74 89.15,52.2 88.77,51.82 88.77,40.64 91.82,37.59 91.82,29.34 95.12,26.04 103.76,26.04 110.24,19.56 116.46,19.56 118.24,17.78 ADCH.4
ADC12  (via drill 0.41)
  Top 0.203: IC3.85 89.26,51.66 89.66,52.07 89.66,54.61 90.17,55.12 v90.17,57.02
  Bottom 0.203: v90.17,57.02 90.17,55.12 89.66,54.61 89.66,52.07 89.28,51.69 89.28,40.77 92.33,37.72 92.33,29.59 95.25,26.67 103.89,26.67 110.49,20.07 116.84,20.07 118.75,18.16 120.4,18.16 120.78,17.78 ADCH.5
ADC13  (via drill 0.41)
  Top 0.203: IC3.84 89.76,51.53 90.17,51.94 90.17,54.48 90.68,54.99 90.68,56.26 91.06,56.64 v91.06,57.91
  Bottom 0.203: v91.06,57.91 91.06,56.64 90.68,56.26 90.68,54.99 90.17,54.48 90.17,51.94 89.79,51.56 89.79,40.89 92.84,37.85 92.84,29.84 95.38,27.3 104.14,27.3 110.87,20.57 117.22,20.57 119,18.8 122.17,18.8 123.32,17.65 ADCH.6
ADC14  (via drill 0.41)
  Top 0.203: IC3.83 90.26,51.4 90.68,51.82 90.68,54.23 91.57,55.12 v91.57,55.75
  Bottom 0.203: v91.57,55.75 91.57,55.12 90.68,54.23 90.68,51.82 90.3,51.44 90.3,41.02 93.34,37.97 93.34,30.1 95.5,27.94 104.39,27.94 111.25,21.08 117.6,21.08 119.25,19.43 124.21,19.43 125.86,17.78 ADCH.7
ADC15  (via drill 0.41)
  Top 0.203: IC3.82 90.76,51.26 91.19,51.69 91.19,53.59 v91.57,53.98
  Bottom 0.203: v91.57,53.98 91.19,53.59 91.19,51.69 90.81,51.31 90.81,41.15 93.85,38.1 93.85,30.35 95.63,28.57 104.65,28.57 111.63,21.59 117.98,21.59 119.51,20.07 125.98,20.07 128.4,17.65 ADCH.8
AREF  (via drill 0.41)
  Top 0.203: C3.1 62.74,61.34 61.98,62.1 61.47,63.12 PWMH.8
  Top 0.254: IC3.98 82.76,51.1 82.3,51.56 82.04,51.56 81.41,52.07 v79.05,52.07
  Top 0.305: v66.05,59.76 65.92,60.02 C3.1
  Bottom 0.305: PWMH.8 61.09,64.26 | v66.05,59.76 66.71,58.93 77.47,58.93 78.53,58.17 78.53,52.88 v79.05,52.07
DTR  (via drill 0.41)
  Top 0.305: C7.1 62.04,34.25 v61.24,34.28
  Top 0.406: IC5.13 v56.2,45.6
  Bottom 0.254: v61.24,34.28 60.84,35.28 59.69,38.17 59.63,38.22
  Bottom 0.406: v56.2,45.6 59.7,37.9 UBOOT.1 | UBOOT.1 59.6,38.1 | UBOOT.1 59.69,38.17
GND  (via drill 0.41)
  Top 0.203: 91.19,48.9 91.26,48.97 IC3.81 91.29,50.06 | 91.26,51 91.26,50.09 91.29,50.06 | IC3.32 84.76,35.1 84.84,35.18 89.79,35.18 | IC3.32 | IC3.32 84.76,33.2 83.95,32.38 | 91.29,50.06 91.31,50.04
  Top 0.254: C6.2 76.1,43.2 78.4,43.2 78.9,43.1 79.7,43.1
  Top 0.305: IC2.1 46.48,18.8 IC1.1 | 82.35,48.82 82.25,48.92 IC3.99 | IC3.11 79.82,43.06 79.83,43.08 81.28,43.08 | 81.28,43.08 81.36,43.08 | 93.02,41.58 93.04,41.55 IC3.62 | 95.78,41.55 95.78,41.56 IC3.62 | 91.26,51 92.2,51.94 v92,51.48 | 81.28,43.08 81.28,43.05 81.31,43.08 81.38,43.08 | 75.31,42.94 75.56,44.2 | 96.9,41.53 96.88,41.55 IC3.62
  Top 0.406: POWER.4 76.42,17.25 | 93.02,41.58 92.96,41.53 v92.84,41.66 | v82.17,47.12 82.17,48.64 82.35,48.82
  Top 0.61: v92.84,41.66 92.84,41.53 | 81.38,43.08 v82.04,42.42
  Top 0.813: JP3.1 JP4.1 | IC2.1 48.6,18.85
  Bottom 0.406: v82.04,42.42 82.04,42.8 82.68,43.43 82.68,46.99 v82.17,47.12 | v92,51.48 92.2,51.69 91.44,50.93 | v92.84,41.66 91.44,43.05
  Bottom 0.813: v97.79,45.09 96.83,45.09 95.94,44.2 95.89,44.2 93.34,41.66 v92.84,41.66 | 130.68,21.59 JP3.1
  other vias: 55.42,39.55 105.96,33.72 74.48,35.02 69.75,43.42 124.59,52.32 124.71,34.67 109.45,49.43 61.85,26.54 69.6,29.72 80.52,35.02 52.01,42.13 69.23,38.57 95.25,55.12 114.45,61.52 80.67,53.9 81.66,41.02 86.44,19.78 58.74,17.05 61.04,39.91 61.14,57.77 97.79,41.53 95,34.16 43.36,31.66 74.68,38.35 114.94,41.4 113.67,31.76 136.56,49.97 116.84,37.59 107.31,37.59 108.58,40.77 49.51,33.22 107.3,45.81 99.96,33.72 52.11,39.58 136.76,30.23 103.11,65.15 59.04,64.52 55.24,33.91 80.28,28.81 69.2,60.83 50.41,45.7 47.63,45.51 68.91,23.71 71.75,28.45 55.99,20.51 31.75,47.73 39.1,51.97 35.95,47.26 25.19,57.98 24.35,57.98 25.19,56.86 24.35,56.86 26.79,55.59 39.24,36.58 39.24,34.04 34.45,42.01 30.2,45.31 27.55,45.01 35.8,42.11 27.95,35.56 130.81,88.55 103.01,89.45 95.01,91 100.36,85.2 106.46,89.15 93.11,89.25 104.21,79.95 1.41,98.4 34.51,33.86 119.96,74.4 113.16,71.05 100.51,87.2 108.06,83.35 94.46,86.7 120.86,95 29.84,54.54 37.04,49.74 29.89,56.84 27.05,40.56 41.75,53.77 37,55.12 111.01,83.8 98.41,22.27 107.21,19.72 27.7,48.48 23.95,40.56 62.79,41.36 66.9,46.62 60.05,48.97 78.22,51.3 69.74,48.62 70.19,56.92 32.29,58.44 120.01,83.05 126.31,85.7 120.01,79.95 106.91,70.5 35.85,39.31 75.46,42.72 97.95,53.32 83.18,32.01 27.8,50.28 25.4,53.28 105.21,87.05 84.61,90.5 122.91,84.1 92.47,57.8 97.67,61.5 95.01,85.3 93.11,84 90.81,92 148.81,64.6 148.41,35.3 135.81,1.7 1.01,1.1 49.61,38.72 73.48,28.81 43.23,48.11 42.13,38.61 56.21,48 56.21,42.4 120.01,67.3 85.34,16.38
  pour Top (isolate 0.305, rank 2): 0,100 137,100 150,65 150,35 137,0 0,0
  pour Bottom (isolate 0.356, rank 2): 0,0 0,100 137,100 150,65 150,35 137,0
M8RXD
  Top 0.254: IC5.9 60.94,42.39 63.55,42.39 R16.1 64.13,41.49
M8TXD
  Top 0.254: IC5.8 61.3,40.8 R15.1
MISO2
  Top 0.254: IC5.17 56.1,50.8 50.9,54.28 50.1,55.05 50.05,55.1 50.05,58.7 50.8,59.45 52.15,59.45 ICSP1.1
MOSI2
  Top 0.254: IC5.16 57.6,50.65 52.17,54.14 ICSP1.4
N$1
  Top 0.254: R23.1 R37.1 31.05,57.25 25.5,62.85 22.15,73.1 21.05,82.7 J44.D+
N$2
  Top 0.254: LED2.A R7.1
N$3
  Top 0.254: R5.1 ON.A
N$4
  Top 0.406: R28.1 R33.1 38.5,62 SV1.2
N$5
  Top 0.254: R32.1 40.3,60.85 40.3,60.8
  Top 0.406: SV1.3 40.25,61.75 40.3,60.8 40.3,60.7 | R32.1 R29.1
N$6
  Top 0.254: R10.1 39.19,42.66 39.19,42.68
  Top 0.406: IC4.10 38.45,42.9 39.19,42.68 39.3,42.65 39.4,42.6
N$7
  Top 0.254: R11.1 IC4.14
N$8  (via drill 0.41)
  Top 0.254: v36,50.35 IC4.17 | v33.35,58.8 v30.3,61
  Top 0.406: v27.1,59.15 IC8.4
  Bottom 0.254: v33.35,58.8 v36,50.35 | v30.3,61 v27.1,59.15
N$9
  Top 0.254: IC4.1 30.4,35.7 29.92,34.04 | 29.92,34.04 C21.1 29.6,31.95 29.55,31.45 R18.1 | R17.1 29.97,34.19 29.92,34.04
N$10
  Top 0.254: R26.1 R35.1 20.2,51 18.5,52.9 16.9,75.2 J45.D+
N$11
  Top 0.254: C8.1 R20.1 32.75,40.6 IC4.4
N$12
  Top 0.254: IC4.21 32.65,50.05 32.2,50.8 28.55,52.3 28.5,54.1 28.85,57.25 28.35,57.75 IC8.3
N$13  (via drill 0.41)
  Top 0.254: IC4.18 35.25,50.8 35.3,52.1 35.8,52.4 35.8,55.75 34.4,56.05 34.25,57.7 34.2,59.2 v29.8,62.25 | IC8.5 22.4,58.39 22.4,61.2 23.7,62.2 23.8,62.4 24,63.3 R50.1 v23.95,63.25
  Bottom 0.254: v23.95,63.25 v29.8,62.25
N$14
  Top 0.254: IC4.22 31.7,50.45 28.05,52.05 27.95,53.9 24.1,55.9 IC8.8 22.5,56.44 R51.1
N$15  (via drill 0.41)
  Top 0.254: 21.3,57.95 21.7,57.7 22,57.69 22,57.74 IC8.6
  Top 0.406: PC3.+ 25.5,76.9
  Top 0.61: v21.2,59.1 21.3,57.95
  Top 1.27: 25.2,77.2 PC3.+
  Top 1.422: J44.+ 24.8,81.1 25.2,77.2 v25.45,75.4
  Bottom 1.422: v25.45,75.4 v21.2,59.1
N$16
  Top 0.254: 21.6,57.05 21.9,57.1 IC8.7
  Top 0.406: 19.9,57.4 21.6,57.05 | 18.35,80.25 18.1,79.4
  Top 1.27: 19.4,63.7 PC8.+
  Top 1.422: J45.+ 18.35,80.25 19.4,63.7 19.9,57.4
N$17
  Top 0.254: IC4.20 33.55,50.05 R23.2 C15.2
N$18
  Top 0.406: R28.2 C17.2 38,49 IC4.16
N$19
  Top 0.406: IC4.15 38.5,46.95 39.9,51.7 C16.2 R29.2
N$20
  Top 0.254: IC4.19 34.5,51.4 C12.2 R25.2
N$21
  Top 0.254: IC4.24 29.3,49.45 C14.2 R26.2
N$22
  Top 0.254: R27.2 C11.2 28,51.2 31.1,50.15 IC4.23
N$23
  Top 0.254: IC4.12 38.75,44.55 41.9,44.55 42.6,45 42.6,45.3 R21.2 C18.2
N$24
  Top 0.254: C19.2 R22.2 41.9,43.75 IC4.11
N$25
  Top 0.254: IC5.30 46.7,44 45.35,43.95 R22.1 44.4,43.4 R31.1
N$26
  Top 0.254: IC5.29 45.25,44.7 R21.1 R30.1
N$27
  Top 0.254: IC4.2 31.15,37.5 C20.1 31.4,31.75 R19.1
N$28
  Top 0.254: R25.1 33.7,55.9 R36.1 31.8,57.6 26.05,63.1 24.55,68 23.55,70.95 22.7,73.9 21.7,83.2 J44.D-
N$29
  Top 0.305: R24.2 115.7,68.2 111.9,68.1 D1.C
N$30  (via drill 0.41)
  Top 0.254: R24.1
  Top 0.305: R39.2 v109.5,83.8 | v116.4,71.8 R24.1 116.5,69.9 | R24.1 C26.1 R40.1
  Top 0.406: IC9.2 101.8,87.6 102.9,86 103.7,85.2 105.7,85.2 R39.2
  Bottom 0.305: v109.5,83.8 116.2,78.3 v116.4,71.8
N$31
  Top 0.254: R27.1 R34.1 19.04,53.07 18.8,57.1 17.3,77.4 J45.D-
N$32
  Top 0.406: IC9.1 102.7,87.7 103.5,86.7 R41.1 R38.2
N$33
  Top 0.254: C23.2 99.54,98.38 100.05,97.84 D2.K
  Top 0.406: 87.7,98.3 87.65,98.3 PC5.+
  Top 1.27: 98.7,98.4 99.54,98.38
  Top 2.54: 78,98.2 J47.4 77.9,98.3 87.7,98.3 | PC5.+ PC4.+ 98.7,98.4
N$34
  Top 0.406: IC4.27 26.75,45.8 Y3.3
N$35
  Top 0.254: D2.A 99.7,94.35 99.7,92.89 | R39.1 108.6,86.64 108.6,86.6
  Top 0.406: 108.1,87.3 108.6,86.6
  Top 0.61: L1.1 108.1,92.7 108.1,87.3
  Top 0.813: U$6.2 U$6.1 96.1,91.2 97.1,91.2 97.1,90 97.4,90 97.4,91.1 | U$6.6 U$6.5 97.4,91.1 | 97.4,91.1 98.28,92.16
  Top 2.54: L1.1 100.1,92.9 99.7,92.89 98.28,92.16 96.9,92
N$36
  Top 0.406: IC9.7 101.7,82.9 101.5,82.2 99.3,82.1 C24.1
N$37  (via drill 0.41)
  Top 0.813: 43.94,21.08 IC1.2
  other vias: 41.7,21 36.6,21.2 39.2,23.4 36.5,18.85 39.25,18.9 36.5,23.4 41.75,23.35 41.7,19 46.4,17.35 46.6,25.3 38.2,26.2 39.65,26.15 44.5,21.1
  pour Top: 34.3,27.5 47.3,27.5 47.3,15.65 34.3,15.65
  pour Bottom: 34.3,27.45 47.3,27.4 47.4,15.65 34.3,15.65
N$38
  Top 0.406: IC9.4 100.4,89.1 100.9,89.6 R43.2 R42.1 107.1,91 C25.1
N$39
  Top 0.254: D5.A 101.3,68.85 101.3,68.7
  Top 0.305: R48.1 103.93,70.62
  Top 0.406: 107.15,72.8 108.3,72.8 PC10.+
  Top 0.813: IC7.1 97.7,69.5 101.3,69.4 101.3,68.7 | R48.1 102.4,69.1 D5.A | 103.9,70.5 103.93,70.62 R47.2 104.7,72.8 107.15,72.8
N$40
  Top 0.406: IC9.8 104.2,83.5 C22.1
  Top 0.61: R45.2 D3.3 121,81.9 117.1,81.3 105.5,81.3 105,81.7 C22.1
N$41
  Top 0.254: R43.1 99.6,90.3 99.6,90.4
  Top 0.406: 99.6,90.4 99.8,90.3
  Top 0.61: 98.5,90.1 U$6.4 99.4,90.4 99.6,90.4
  Top 0.813: 98.5,90.1 98.5,88.8 97.9,88.5 R44.1
N$42
  Top 1.016: 143.5,59.1 F3.1 144.2,58.7 | 144.2,58.7 144.4,58.9 | 144.3,58.6 144.2,58.7
  Top 2.184: J49.1 144.4,58.9
  Top 2.54: F2.1 J49.1
N$43
  Top 0.406: 101,83.1 IC9.6
  Top 0.61: R46.2 99.8,83.1 101,83.1
N$44
  Top 0.254: 96.7,86.3 97,86.3 97,86.1 96.91,86.1 R46.1
  Top 0.61: U$6.3 96.3,89.2 96.4,87.4 96.4,87.3 96.6,86.7 96.7,86.3
N$45
  Top 0.254: J43.2 22.3,16.2 22.4,16.2 27.1,21.95 R19.2
N$46
  Top 0.254: R18.2 30.2,28.2 26.75,22.41 22.1,16.7 16.7,16.15 15,16.7 J43.3
N$47
  Top 0.254: D4.A 93.03,78.3 93.03,78.23
  Top 0.813: IC7.2 98.9,72.1 101.2,72.4 D5.K 102.2,75.1 R47.1 104.7,75.29 104.7,75.9 PC11.+
  Top 1.778: 93.2,71.8 IC7.2
  Top 2.54: J47.2 72.1,93.3 80.2,89.4 86.5,81.2 90.9,79.9 93.03,78.23 93.2,78.1 93.2,71.8
N$48
  Top 0.813: 86.5,73.2 88.8,73.1 Q2.C
  Top 2.54: J47.1 67.6,95 70.4,85.8 75.4,80.1 86.5,73.2
N$49
  Top 2.54: J46.4 RELAY1.2
  Bottom 2.54: J46.4 RELAY1.2
N$50  (via drill 0.3)
  Top 0.254: 46.1,98 46.1,97.8 J46.1 46.15,98 46.05,98 | 46.35,82.2 46.58,82.54 | RELAY2.1 50.6,72.9 50.7,72.1 50.65,72.9
  Top 2.54: 46.05,98 46.05,83.2 | 46.35,82.2 50.65,72.9 v49.3,75.9
  Bottom 0.254: v49.3,75.9 50.7,72.9
  Bottom 2.54: J46.1 46.25,82.6 50.7,72.9
N$51
  Top 0.305: 50.6,86.9 50.6,87 RELAY1.1 50.7,87.4 51.3,87.4
  Top 2.54: J46.3 53.2,93.8 | 51.3,87.4 51.5,87.3
  Top 3.81: 53.2,93.8 51.3,87.4
N$52
  Top 0.254: 89.11,70.51 R49.2
  Top 0.813: Q2.B 89.11,70.51
N$53
  Bottom 2.54: J46.2 50.4,94.5
  Bottom 3.81: 50.4,94.5 55.3,89.4 RELAY2.2
N$54
  Top 0.254: LED4.A R14.2
N$55
  Top 0.254: LED3.A R13.2
PA0  (via drill 0.3, 0.41)
  Top 0.203: IC3.78 92.76,51.61 93.22,52.07 93.22,56.9 95.38,59.05 127.25,59.05 130.18,61.98 XIOH.16
  Top 0.254: 95.38,59.05 v96.9,60.6 | 93.4,68.6 R49.1 v94.6,68.7
  Bottom 0.254: v96.9,60.6 94.1,62.8 94.1,65.9 v94.6,68.7
PA1
  Top 0.203: IC3.77 93.26,51.35 93.73,51.82 93.73,56.64 95.63,58.55 127.76,58.55 129.92,60.71 132.21,60.71 XIOH.15
PA2
  Top 0.203: XIOH.14 129.67,59.44 128.27,58.04 95.89,58.04 94.23,56.39 94.23,51.56 93.76,51.09 IC3.76
PA3
  Top 0.203: XIOH.13 132.21,58.17 129.16,58.17 128.52,57.53 100.23,57.53 99.1,56.7 99.1,53.08 96.39,51.07 96.39,48.39 96.07,48.06 IC3.75
PA4
  Top 0.203: IC3.74 96.71,47.56 96.9,47.75 96.9,50.94 99.61,52.85 99.61,56.31 100.61,57.02 129.54,57.02 129.67,56.9 XIOH.12
PA5
  Top 0.203: IC3.73 96.97,47.06 97.41,47.5 97.41,50.69 100.11,52.59 100.11,55.91 100.92,56.52 128.52,56.52 129.41,55.63 132.21,55.63 XIOH.11
PA6
  Top 0.203: IC3.72 97.23,46.56 97.92,47.24 97.92,50.44 100.62,52.34 100.62,55.53 101.3,56.01 127.76,56.01 129.41,54.36 XIOH.10
PA7
  Top 0.203: IC3.71 97.5,46.06 98.42,46.99 98.42,50.18 101.13,52.19 101.13,55.12 101.61,55.5 127,55.5 129.41,53.09 132.21,53.09 XIOH.9
PB0  (via drill 0.41)
  Top 0.203: IC3.19 82.35,39.06 v82.17,39.12 | v86.36,25.27 87,25.27 87.25,25.53 129.29,25.53 129.67,25.15 132.21,25.15 XIOL.1
  Bottom 0.203: v82.17,39.12 82.3,39.12 85.6,35.81 85.6,25.91 v86.36,25.27
PB1  (via drill 0.41)
  Top 0.203: IC3.20 78.15,38.56 v77.85,38.86 | XIOL.2 129.67,23.88 128.52,25.02 112.14,25.02 111.76,24.64 v110.87,24.64 110.49,25.02 87.5,25.02 86.74,24.26 86.44,24.26 v86.19,24
  Bottom 0.203: v77.85,38.86 81.15,38.86 82.93,37.08 83.57,37.08 85.09,35.56 85.09,24.64 85.72,24 v86.19,24 | 100.71,41.66 101.65,40.72 101.65,32.02 103.96,29.72
  Bottom 0.254: 100.71,41.66 ICSP.3
  Bottom 0.305: 103.96,29.72 105.79,29.72 v110.87,24.64
PB2  (via drill 0.41)
  Top 0.203: IC3.21 78.19,38.06 77.98,37.85 v76.83,37.85 | XIOL.3 134.75,25.15 134.75,23.24 134.11,22.61 129.67,22.61 127.76,24.51 114.43,24.51 113.79,23.88 v112.78,23.88 112.65,23.75 110.62,23.75 109.86,24.51 88.3,24.51 v87.63,23.84
  Bottom 0.203: v76.83,37.85 77.98,37.85 78.61,38.35 81.03,38.35 82.8,36.58 83.31,36.58 84.58,35.31 84.58,24.26 85.72,23.11 86.9,23.11 v87.63,23.84 | ICSP.4 103.38,41.66 104.27,40.77
  Bottom 0.254: 104.27,40.77 104.27,38.48 102.62,36.83 102.62,32.82 104.45,30.99 | 111.76,26.16 112.78,25.02 v112.78,23.88
  Bottom 0.305: 104.45,30.99 106.93,30.99 111.76,26.16
PB3  (via drill 0.41)
  Top 0.203: IC3.22 81.31,37.56 81.53,37.34 v81.53,36.7 | v117.98,22.48 117.98,22.86 116.97,23.88 114.81,23.88 114.05,23.11 110.49,23.11 109.6,24 89.53,24 87.88,22.35 v85.98,22.35
  Bottom 0.203: v117.98,22.48 118.11,22.48 119.89,20.7 126.62,20.7 128.14,19.18 133.86,19.18 135,20.32 135,24.26 134.11,25.15 132.21,25.15 XIOL.4 | v81.53,36.7 82.04,36.7 82.68,36.07 83.06,36.07 84.07,35.05 84.07,24 85.72,22.35 v85.98,22.35 | ICSP.1 102.06,42.72 102.06,32.44 104.14,30.35
  Bottom 0.254: v117.98,22.48 117.98,22.99 117.35,23.62 115.06,23.62 114.3,22.86 112.52,22.86 111.89,23.5 111.89,24.89 111.12,25.65 | 106.43,30.35 104.14,30.35
  Bottom 0.305: 111.12,25.65 106.43,30.35
PB4
  Top 0.203: PWMH.3 73.79,63.37 72.26,61.85 72.26,38.1 73.28,37.08 79.88,37.08 79.86,37.06 IC3.23
PB5
  Top 0.203: IC3.24 73.04,36.56 71.75,37.85 71.75,62.23 71.25,62.74 PWMH.4
PB6
  Top 0.203: IC3.25 79.88,36.06 79.88,36.07 72.77,36.07 71.25,37.59 71.25,61.34 68.71,63.88 PWMH.5
PB7  (via drill 0.41)
  Top 0.203: IC3.26 81.18,34.06 81.05,33.94 74.14,33.94 70.74,37.34 | 70.74,47.3 70.74,47.55
  Top 0.254: 70.74,37.34 70.74,47.3 70.74,47.6 | R7.2 70.35,47.65 70.74,47.6 | v68.23,57.02 70.8,54.7 70.74,47.6
  Bottom 0.254: PWMH.6 66.17,63.25 63.75,61.09 63.75,58.93 63.76,58.04 66.55,57.4 67.18,57.3 v68.23,57.02
PC0
  Top 0.203: IC3.53 98.45,37.06 99.69,35.81 117.98,35.81 125.09,42.93 132.21,42.93 XIOH.1
PC1
  Top 0.203: IC3.54 98.71,37.56 99.82,36.32 117.47,36.32 125.35,44.2 XIOH.2
PC2
  Top 0.203: IC3.55 98.97,38.06 100.08,36.96 105.28,36.96 107.06,38.73 119,38.73 125.73,45.47 132.21,45.47 XIOH.3
PC3
  Top 0.203: IC3.56 99.23,38.56 100.33,37.47 105.16,37.47 106.93,39.24 118.49,39.24 125.98,46.74 XIOH.4
PC4
  Top 0.203: IC3.57 98.88,39.06 100,40.18 104.32,40.18 106.93,42.8 120.78,42.8 125.98,48.01 132.21,48.01 XIOH.5
PC5
  Top 0.203: IC3.58 98.62,39.56 99.64,40.59 103.96,40.59 106.81,43.43 120.52,43.43 126.36,49.28 XIOH.6
PC6
  Top 0.203: IC3.59 98.48,40.06 99.44,41.02 99.44,42.42 99.75,42.72 104.85,42.72 106.2,44.07 120.14,44.07 126.62,50.55 132.21,50.55 XIOH.7
PC7
  Top 0.203: IC3.60 98.35,40.56 98.93,41.15 98.93,42.55 99.52,43.13 104.57,43.13 106.02,44.58 119.63,44.58 122.9,47.8 | XIOH.8 126.87,51.82 122.9,47.9
  Top 0.254: 122.9,47.9 122.9,47.8
PD7
  Top 0.203: XIOL.16 124.97,41.66 118.62,35.31 97.26,35.31 97.26,35.28 96.65,34.67 96.65,34.29 95.12,32.77 95,32.77 94.36,32.13 93.85,32.13 93.76,32.23 IC3.50
PE0  (via drill 0.41)
  Top 0.203: PWML.1 98.42,62.48 96.65,62.48 95,60.83 89.79,60.83 88.14,59.18 82.55,59.18 81.53,58.17 78.87,55.57 77.34,54.04 77.34,50.42 v77.6,50.16 79.12,48.64 80.64,48.64 80.9,48.39 80.9,47.75 80.71,47.56 IC3.2
  Top 0.254: v68.78,44.04 66.79,42.12 R16.2
  Bottom 0.254: v68.78,44.04 75.56,50.16 v77.6,50.16
PE1  (via drill 0.41)
  Top 0.203: v77.34,48.4 76.83,49.4 76.83,54.37 76.87,54.5 81.41,58.8 82.3,59.69 87.76,59.69 89.41,61.34 94.74,61.34 96.39,62.99 97.92,62.99 PWML.2 | v76.68,47.04 76.73,47.09 76.91,47.06 IC3.3
  Top 0.254: v69.33,41.96 67,40.15 65.31,39.36 R15.2 65.3,39.3
  Bottom 0.203: v77.34,48.4 77.34,48.01 v76.68,47.04
  Bottom 0.254: v76.68,47.04 72.07,43.46 v69.33,41.96
PE3  (via drill 0.41)
  Top 0.203: IC3.5 76.49,46.06 75.82,46.64 75.82,54.92 78.87,57.97 81.15,60.07 82.04,60.96 86.23,60.96 v86.36,61.09
  Bottom 0.203: v86.36,61.09 86.36,61.34 87.76,62.74 87.76,64.26 87.63,64.39 PWML.6
PE4
  Top 0.203: IC3.6 75.98,45.56 75.31,46.23 75.31,55.15 78.87,58.71 80.9,60.71 81.66,61.47 83.95,61.47 84.33,61.85 94.23,61.85 95.38,62.99 PWML.3
PE5
  Top 0.203: IC3.7 79.73,45.06 79.5,45.09 75.69,45.09 74.8,45.97 74.8,55.58 78.97,59.54 80.9,61.34 81.53,61.98 83.57,61.98 83.95,62.36 92.33,62.36 92.84,62.87 PWML.4
PG0  (via drill 0.41)
  Top 0.203: IC3.51 95.76,35.56 v96.01,35.18 | XIOL.13 132.21,37.85 125.09,37.85 121.03,33.78 108.71,33.78 107.06,32.13 96.65,32.13 96.39,32.38 v96.01,32.38
  Bottom 0.203: v96.01,32.38 v96.01,35.18
PG1  (via drill 0.41)
  Top 0.203: IC3.52 97.39,36.56 v97.79,36.2 | XIOL.14 125.09,39.12 120.27,34.29 108.08,34.29 106.55,32.77 97.28,32.77 96.9,33.15 v96.9,33.27
  Bottom 0.203: v96.9,33.27 97.54,33.27 98.3,34.04 98.3,35.69 v97.79,36.2
PG2  (via drill 0.41)
  Top 0.203: IC3.70 96.75,45.56 96.88,45.44 96.88,43.2 v97.28,42.8 | v97.54,34.42 98.04,34.42 98.42,34.8 119.51,34.8 125.09,40.39 132.21,40.39 XIOL.15
  Bottom 0.203: v97.54,34.42 97.16,34.42 96.9,34.67 96.9,42.29 v97.28,42.8
PG5  (via drill 0.41)
  Top 0.203: IC3.1 79.69,48.06 79.63,48.01 78.89,48.01 78.4,48 77.6,47.5 77,47.7 76.33,47.87 76.33,54.7 78.87,57.24 81.28,59.44 82.04,60.2 86.69,60.2 v87.53,61.03
  Bottom 0.203: PWML.5 90.3,62.36 89.53,61.59 88.39,61.59 v87.53,61.03
PH3
  Top 0.203: IC3.15 74.38,41.06 74.3,41.15 74.3,55.9 78.87,60.18 80.77,61.98 81.28,62.48 83.19,62.48 PWML.7
PH4
  Top 0.203: IC3.16 74.12,40.56 73.79,40.89 73.79,56.13 78.87,61.01 80.52,62.61 82.68,64.77 PWML.8
  Top 0.305: D1.A 105,67.1 83.1,67.1 PWML.8
PH5
  Top 0.203: IC3.17 73.86,40.06 73.28,40.64 73.28,58.31 76.58,61.61 77.6,62.61 78.87,63.88 PWMH.1
PH6
  Top 0.203: PWMH.2 76.33,63.63 72.77,60.07 72.77,40.39 73.53,39.62 79.63,39.62 79.69,39.56 IC3.18
PL0
  Top 0.203: 86.23,34.01 86.23,27.94 88.14,26.04 127.25,26.04 128.91,27.69 132.21,27.69 XIOL.5
  Top 0.254: IC3.35 86.26,34.04 86.23,34.01
PL1
  Top 0.203: IC3.36 86.76,28.18 88.39,26.54 126.49,26.54 128.91,28.96 XIOL.6
PL2
  Top 0.203: 87.25,34.01 87.25,28.7 88.9,27.05 125.86,27.05 129.03,30.23 132.21,30.23 XIOL.7
  Top 0.254: IC3.37 87.22,34.04 87.25,34.01
PL3
  Top 0.203: IC3.38 87.76,29.21 89.41,27.56 125.22,27.56 129.16,31.5 XIOL.8
PL4
  Top 0.203: 88.27,33.93 88.27,29.46 89.66,28.07 124.59,28.07 129.29,32.77 132.21,32.77 XIOL.9
  Top 0.254: IC3.39 88.26,33.99 88.29,33.96 88.27,33.93
PL5
  Top 0.203: IC3.40 88.76,29.73 89.92,28.57 123.95,28.57 129.41,34.04 XIOL.10
PL6
  Top 0.203: 89.28,33.96 89.28,30.23 90.42,29.08 123.44,29.08 129.67,35.31 132.21,35.31 XIOL.11
  Top 0.254: IC3.41 89.26,34.04 89.23,34.01 89.28,33.96
PL7
  Top 0.203: IC3.42 89.76,30.77 90.93,29.59 122.68,29.59 129.67,36.58 XIOL.12
RESET  (via drill 0.41)
  Top 0.254: POWER.1 69.98,23.62 70.58,25.38 R6.2 | 83.76,33.16 83.49,32.89 81.15,32.89 80.64,33.4 | 71.25,26.92 v71.5,26.92 R6.2 | 70.61,30.86 R6.2 | C1.1 69,32.7 | 69,32.7 69,32.65 | 65.35,33.38 63.7,31.5 RESET.3 RESET.4 | RESET-EN.2 69,32.7
  Top 0.305: 83.76,33.16 IC3.30 | 80.64,33.4 72.64,33.4 70.61,30.86 70.57,30.96 69.97,31.76 RESET-EN.2 RESET-EN.1 67.21,32.18 67.66,32.63 67.2,32.43 65.35,33.38 C7.2
  Top 0.406: v84.71,21.88 84.84,21.97 85.47,21.34 86.49,21.34 86.74,21.59 88.01,21.59 89.92,23.5 109.09,23.5 110.24,22.35 115.44,22.35 v115.57,22.48
  Bottom 0.254: 100.71,38.99 101.22,38.48 101.22,31.5 103.63,29.08
  Bottom 0.305: v71.5,26.92 74.42,24.64 81.15,24.64 v84.71,21.88 | v115.57,22.48 115.06,22.48 114.94,22.35 111.89,22.35 105.16,29.08 103.63,29.08 | 100.71,38.99 ICSP.5
RESET2
  Top 0.254: ICSP1.5 47,58 47,53.85 R12.2 47.5,53.3 50.45,50.9 IC5.24
RXD1  (via drill 0.41)
  Top 0.203: IC3.45 91.29,34.06 91.31,34.04 91.31,32 92.25,31.06 108.92,31.06 v109.6,31.62
  Bottom 0.203: COMMUNICATION.3 118.24,56.39 111.12,49.28 111.12,33.27 v109.6,31.62
RXD2  (via drill 0.41)
  Top 0.203: IC3.12 78,42.56 v77.88,42.34
  Top 0.254: v82.6,55.6 v83,57.7
  Bottom 0.203: v77.88,42.34 77.98,43.81 79.63,45.47 79.63,50.8 80.39,51.56 80.39,52.7 79.63,53.47 79.63,54.46 79.7,54.53 81.7,55.5 v82.6,55.6 83.4,56.5 86,58.6 88.14,58.93 88.9,59.69 92.58,59.69 93.22,59.05 97.41,59.05 100.46,62.1 100.91,62.1 101.8,62.09 104.09,62.09 104.98,62.1 110.62,62.1 111.05,62.08 112.7,62.08 113.16,62.99 COMMUNICATION.5
  Bottom 0.254: v83,57.7 81.4,60.2 81.1,67.5 | 73.5,87 RELAY1.3
  Bottom 0.406: 81.1,67.5 75.6,72.1 73.6,78 73.5,87
RXD3  (via drill 0.41)
  Top 0.203: COMMUNICATION.7 108.08,62.99 107.57,62.48 107.45,62.33 106.56,61.32 v104.01,60.49 | v92.71,43.43 92.71,43.18 93.85,42.04 95.76,42.04 IC3.63
  Bottom 0.203: v104.01,60.49 103.41,59.76 92.41,49.23 92.41,47.32 93.09,46.61 93.22,46.61 93.73,46.1 93.73,44.83 93.34,44.45 92.96,44.45 92.58,44.07 92.58,43.56 v92.71,43.43
RXL
  Top 0.254: IC5.10 59.79,43.16 60.2,43.5 LED4.C
SCK2
  Top 0.254: IC5.15 58.7,47.15 58.7,50.75 52.64,54.6 52.65,56.8 ICSP1.3
SCL  (via drill 0.41)
  Top 0.203: IC3.43 90.26,31.03 91.19,30.1 111.63,30.1 112.01,30.48 v112.27,30.61
  Top 0.254: v113.44,49.28 R9.2
  Bottom 0.203: v112.27,30.61 112.14,30.73 112.14,48.01 116.97,52.83 v113.44,49.28 118.36,54.48 120.78,56.9 120.78,60.71 122.68,62.61 123.32,62.61 COMMUNICATION.1
SDA  (via drill 0.41)
  Top 0.203: v111,31.37 110.24,30.61 91.44,30.61 90.81,31.24 90.81,33.66 90.75,33.76 90.76,33.86 IC3.44
  Top 0.254: R8.2 113.04,50.37
  Top 0.305: v113.92,50.8 113.04,50.37
  Bottom 0.203: v111,31.37 111,32.38 111.63,33.02 111.63,48.64 v113.92,50.8 119.51,56.52 119.51,61.98 120.78,63.25 COMMUNICATION.2
TXD1  (via drill 0.41)
  Top 0.203: IC3.46 91.76,33.97 91.82,33.91 91.82,32.38 92.58,31.62 107.7,31.62 v108.97,32.89
  Bottom 0.203: COMMUNICATION.4 115.7,54.99 110.62,49.91 110.62,33.78 109.6,32.89 v108.97,32.89
TXD2  (via drill 0.41)
  Top 0.203: IC3.13 78.77,42.06 78.36,41.66 76.83,41.66 76.71,41.78 v76.71,42.45
  Bottom 0.203: v76.71,42.45 76.71,43.31 79.12,45.72 79.12,50.93 79.88,51.69 79.88,52.58 79.12,53.34 79.12,54.71 82.31,56.27 83.2,56.9 85.84,59.04 88.01,59.44 88.9,60.33 92.84,60.33 93.47,59.69 97.41,59.69 100.33,62.61 100.84,62.61 101.83,62.6 104.27,62.6 105.05,62.61 110.11,62.61 110.62,63.25 COMMUNICATION.6
  Bottom 0.254: 80.5,67 80.7,63.8 80.7,59.5 82,56.7 82.3,56.3 82.31,56.27
  Bottom 0.406: RELAY2.3 76.3,70.5 80.5,67
TXD3  (via drill 0.41)
  Top 0.203: COMMUNICATION.8 105.11,63.92 105.18,63.78 104.98,63.43 v102.23,60.59 | IC3.64 95.61,42.56 95.5,42.55 94.61,42.55 94.23,42.93 94.23,44.07 v92.71,45.59
  Bottom 0.203: v102.23,60.59 102.28,59.69 91.92,49.61 91.92,46.38 v92.71,45.59
TXL
  Top 0.254: LED3.C 58.62,44.32 IC5.11
VUCAP
  Top 0.254: C10.1 48.1,46.3 IC5.27
XT1
  Top 0.254: R4.2 Y2.3 48.1,33.6 R2.1
XT1R
  Top 0.254: R4.1 IC5.1
XT2
  Top 0.254: IC5.2 51.37,41.33 51.26,39.27 51.23,38.54 51.23,37.91 51.1,36.2 Y2.1 51.1,34.2 R2.2
XTAL1
  Top 0.203: R1.1 R3.2
  Top 0.254: R1.1 78.2,27.3 Y1.3
XTAL1R
  Top 0.203: IC3.34 85.76,32.51 84.39,30.74 82.2,30.74
  Top 0.254: R3.1 82.2,30.74
XTAL2
  Top 0.203: 81.66,31.25 83.91,31.25 85.26,32.89 IC3.33
  Top 0.254: 81.66,31.25 R1.2 79.3,29.7 79.3,29.8 78.6,30.2 Y1.1

## Text on the board
tNames: V | G | + | - | 1 | 1 | Licensed under the TAPR Open | Hardware License - www.tapr.org/OHL | SPI V1.1
ReferenceLC: L | TX | RX | PC1 | PC2
tDocu: + | - | - | - | - | + | + | LEDs | Laser | -12V | +12V | Copyright 2012 Paul Campbell - | Partially based on an Arduino design, buy their stuff | Seeed Order number: 53409